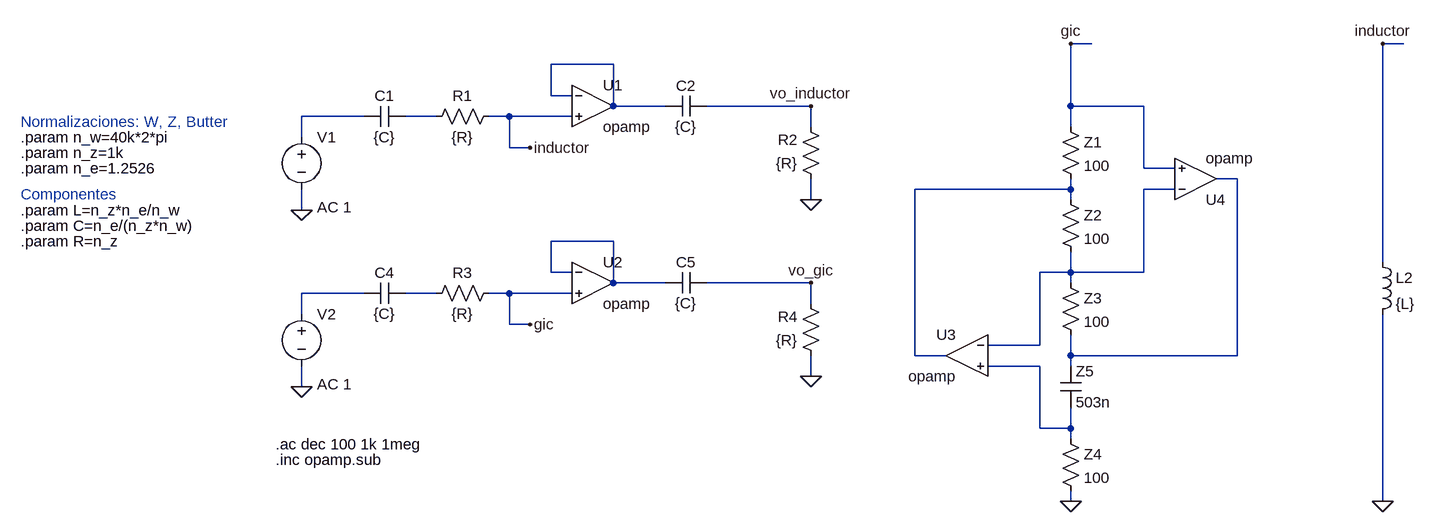
[diagram p0: schematic Tp-Semana4.asc]
Tp-Semana4.asc, the LTspice schematic file:
Version 4
SHEET 1 1840 1604
WIRE 1008 368 976 368
WIRE 1488 368 1456 368
WIRE 272 400 176 400
WIRE 176 448 176 400
WIRE 208 448 176 448
WIRE 272 464 272 400
WIRE 352 464 272 464
WIRE 576 464 416 464
WIRE 976 464 976 368
WIRE 1088 464 976 464
WIRE -112 480 -208 480
WIRE 0 480 -48 480
WIRE 112 480 80 480
WIRE 208 480 112 480
WIRE 576 496 576 464
WIRE 976 496 976 464
WIRE -208 512 -208 480
WIRE 112 528 112 480
WIRE 144 528 112 528
WIRE 1088 560 1088 464
WIRE 1136 560 1088 560
WIRE 1232 576 1200 576
WIRE 976 592 976 576
WIRE 976 592 736 592
WIRE 1136 592 1088 592
WIRE 576 608 576 576
WIRE 976 608 976 592
WIRE -208 624 -208 592
WIRE 272 672 176 672
WIRE 1456 704 1456 368
WIRE 176 720 176 672
WIRE 208 720 176 720
WIRE 976 720 976 688
WIRE 976 720 928 720
WIRE 1088 720 1088 592
WIRE 1088 720 976 720
WIRE 272 736 272 672
WIRE 352 736 272 736
WIRE 576 736 416 736
WIRE 976 736 976 720
WIRE -112 752 -208 752
WIRE 0 752 -48 752
WIRE 112 752 80 752
WIRE 208 752 112 752
WIRE 576 768 576 736
WIRE -208 784 -208 752
WIRE 112 800 112 752
WIRE 144 800 112 800
WIRE 928 832 928 720
WIRE 928 832 848 832
WIRE 736 848 736 592
WIRE 784 848 736 848
WIRE 976 848 976 816
WIRE 1232 848 1232 576
WIRE 1232 848 976 848
WIRE 928 864 848 864
WIRE 976 864 976 848
WIRE 576 880 576 848
WIRE -208 896 -208 864
WIRE 928 960 928 864
WIRE 976 960 976 928
WIRE 976 960 928 960
WIRE 976 976 976 960
WIRE 976 1072 976 1056
WIRE 1456 1072 1456 784
FLAG -208 624 0
FLAG 576 464 vo_inductor
FLAG 576 608 0
FLAG 1456 1072 0
FLAG 144 528 inductor
FLAG 976 368 gic
FLAG 1456 368 inductor
FLAG 976 1072 0
FLAG -208 896 0
FLAG 576 736 vo_gic
FLAG 576 880 0
FLAG 144 800 gic
SYMBOL voltage -208 496 R0
WINDOW 123 24 124 Left 2
WINDOW 39 0 0 Left 0
SYMATTR Value2 AC 1
SYMATTR InstName V1
SYMATTR Value ""
SYMBOL cap -48 464 R90
WINDOW 0 0 32 VBottom 2
WINDOW 3 32 32 VTop 2
SYMATTR InstName C1
SYMATTR Value {C}
SYMBOL res 96 464 R90
WINDOW 3 32 56 VTop 2
WINDOW 0 0 56 VBottom 2
SYMATTR Value {R}
SYMATTR InstName R1
SYMBOL Opamps\\opamp 240 400 R0
SYMATTR InstName U1
SYMBOL res 592 592 R180
WINDOW 0 36 76 Left 2
WINDOW 3 36 40 Left 2
SYMATTR InstName R2
SYMATTR Value {R}
SYMBOL cap 352 480 R270
WINDOW 0 32 32 VTop 2
WINDOW 3 0 32 VBottom 2
SYMATTR InstName C2
SYMATTR Value {C}
SYMBOL Opamps\\opamp 1168 640 M180
SYMATTR InstName U4
SYMBOL Opamps\\opamp 816 784 M0
SYMATTR InstName U3
SYMBOL res 960 480 R0
SYMATTR InstName Z1
SYMATTR Value 100
SYMBOL res 960 720 R0
SYMATTR InstName Z3
SYMATTR Value 100
SYMBOL ind 1440 688 R0
SYMATTR InstName L2
SYMATTR Value {L}
SYMBOL voltage -208 768 R0
WINDOW 123 24 124 Left 2
WINDOW 39 0 0 Left 0
SYMATTR Value2 AC 1
SYMATTR InstName V2
SYMATTR Value ""
SYMBOL cap -48 736 R90
WINDOW 0 0 32 VBottom 2
WINDOW 3 32 32 VTop 2
SYMATTR InstName C4
SYMATTR Value {C}
SYMBOL res 96 736 R90
WINDOW 3 32 56 VTop 2
WINDOW 0 0 56 VBottom 2
SYMATTR Value {R}
SYMATTR InstName R3
SYMBOL Opamps\\opamp 240 672 R0
SYMATTR InstName U2
SYMBOL res 592 864 R180
WINDOW 0 36 76 Left 2
WINDOW 3 36 40 Left 2
SYMATTR InstName R4
SYMATTR Value {R}
SYMBOL cap 352 752 R270
WINDOW 0 32 32 VTop 2
WINDOW 3 0 32 VBottom 2
SYMATTR InstName C5
SYMATTR Value {C}
SYMBOL cap 960 864 R0
SYMATTR InstName Z5
SYMATTR Value 503n
SYMBOL res 960 960 R0
SYMATTR InstName Z4
SYMATTR Value 100
SYMBOL res 960 592 R0
SYMATTR InstName Z2
SYMATTR Value 100
TEXT -248 984 Left 2 !.ac dec 100 1k 1meg
TEXT -640 512 Left 2 !.param n_w=40k*2*pi
TEXT -640 536 Left 2 !.param n_z=1k
TEXT -640 488 Left 2 ;Normalizaciones: W, Z, Butter
TEXT -640 600 Left 2 ;Componentes
TEXT -248 1008 Left 2 !.inc opamp.sub
TEXT -640 560 Left 2 !.param n_e=1.2526
TEXT -640 624 Left 2 !.param L=n_z*n_e/n_w
TEXT -640 648 Left 2 !.param C=n_e/(n_z*n_w)
TEXT -640 672 Left 2 !.param R=n_z

The netlist it stands for:
* Tp-Semana4.asc
V1 N002 0 AC 1
C1 N003 N002 {C}
R1 inductor N003 {R}
XU1 N001 inductor N001 opamp Aol=100K GBW=10Meg  ; pins invin noninvin out
R2 0 vo_inductor {R}
C2 N001 vo_inductor {C}
XU4 N006 gic N004 opamp Aol=100K GBW=10Meg  ; pins invin noninvin out
XU3 N006 N010 N005 opamp Aol=100K GBW=10Meg  ; pins invin noninvin out
R§Z1 gic N005 100
R§Z3 N006 N004 100
L2 inductor 0 {L}
V2 N008 0 AC 1
C4 N009 N008 {C}
R3 gic N009 {R}
XU2 N007 gic N007 opamp Aol=100K GBW=10Meg  ; pins invin noninvin out
R4 0 vo_gic {R}
C5 N007 vo_gic {C}
C§Z5 N004 N010 503n
R§Z4 N010 0 100
R§Z2 N005 N006 100
.ac dec 100 1k 1meg
.param n_w=40k*2*pi
.param n_z=1k
* Normalizaciones: W, Z, Butter
* Componentes
.inc opamp.sub
.param n_e=1.2526
.param L=n_z*n_e/n_w
.param C=n_e/(n_z*n_w)
.param R=n_z
.backanno
.end

* Results of the author's LTspice run, read from the files saved beside the schematic
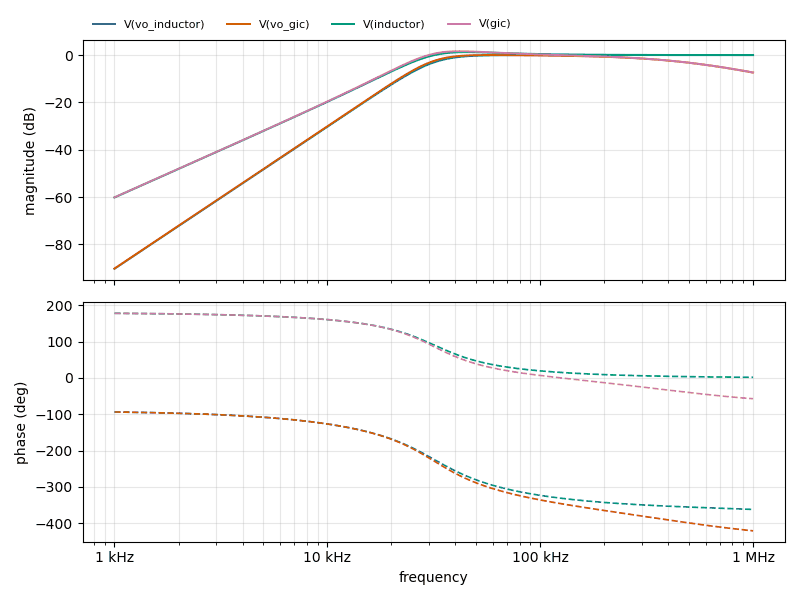
[diagram p1: AC Analysis of Tp-Semana4.asc, plotted from the saved traces]
* AC Analysis, 1 run:
*   V(vo_inductor): -90.25 dB at 1 kHz, -0.04 dB at 1 MHz, peak -0.00 dB at 154.9 kHz, 3 dB below the peak at 31.94 kHz
*   V(vo_gic): -90.17 dB at 1 kHz, -7.41 dB at 1 MHz, peak -0.01 dB at 58.88 kHz, 3 dB below the peak at 30.48 kHz and 474.2 kHz
*   V(inductor): -60.17 dB at 1 kHz, 0.00 dB at 1 MHz, peak 1.25 dB at 44.67 kHz, 3 dB below the peak at 27.32 kHz
*   V(gic): -60.08 dB at 1 kHz, -7.36 dB at 1 MHz, peak 1.61 dB at 41.69 kHz, 3 dB below the peak at 26.84 kHz and 296.7 kHz